# Altium project OSPLC2_2_CPU.PrjPCB
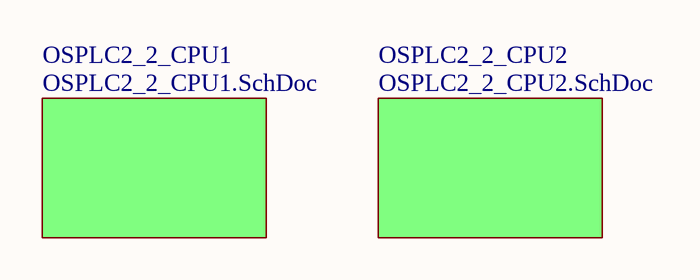
[diagram p0: OSPLC2_2_Top.SchDoc]
3 sheets, 72 parts. Net scope: global (net labels, ports and power ports of the same name join across sheets).
Board file: OSPLC2_2_CPU.PcbDoc
Sheets:
  OSPLC2_2_Top.SchDoc
    OSPLC2_2_CPU1 = OSPLC2_2_CPU1.SchDoc
    OSPLC2_2_CPU2 = OSPLC2_2_CPU2.SchDoc

## Sheet OSPLC2_2_Top.SchDoc
size 294 x 198 mm

### Sub-sheets
OSPLC2_2_CPU1 = OSPLC2_2_CPU1.SchDoc: no entries
OSPLC2_2_CPU2 = OSPLC2_2_CPU2.SchDoc: no entries

## Sheet OSPLC2_2_CPU1.SchDoc
size 294 x 198 mm
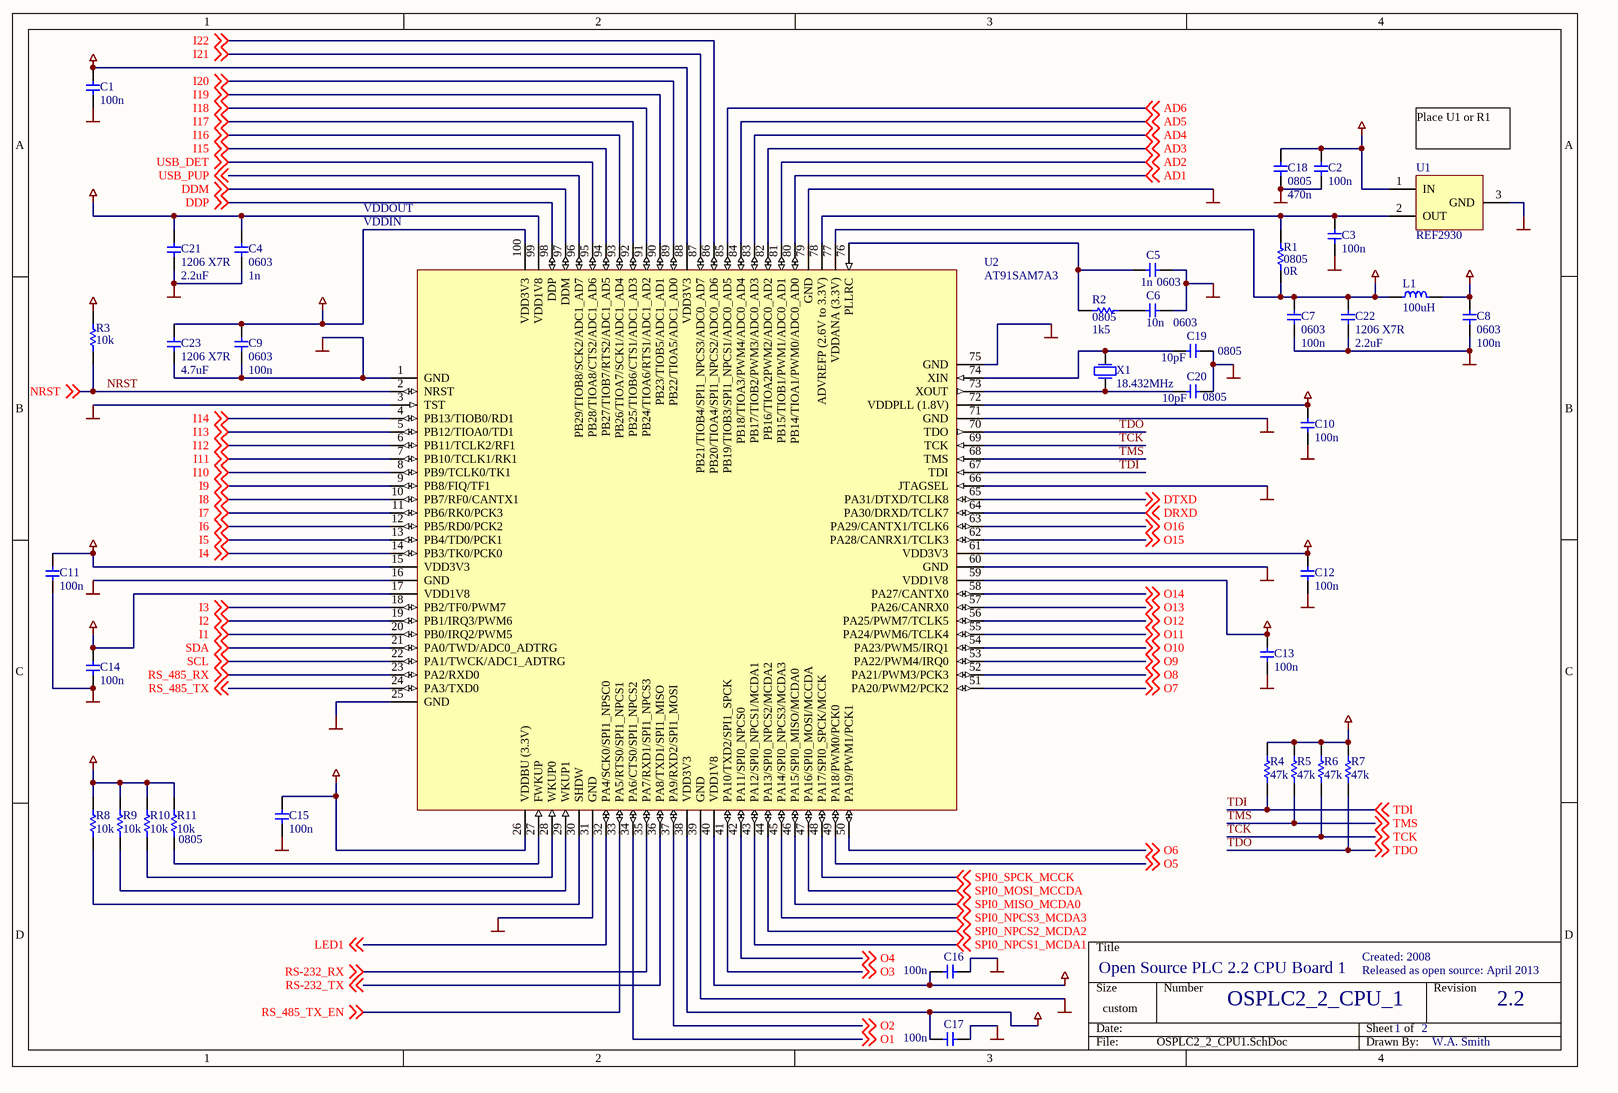
[diagram p1: OSPLC2_2_CPU1.SchDoc]

### Parts
C1  value 100n  [0603]  (hidden comment: 0603)
C2  value 100n  [0603]  (hidden comment: 0603)
C3  value 100n  [0603]  (hidden comment: 0603)
C4  0603  value 1n  [0603]
C5  0603  value 1n  [0603]
C6  0603  value 10n  [0603]
C7  0603  value 100n  [0603]
C8  0603  value 100n  [0603]
C9  0603  value 100n  [0603]
C10  value 100n  [0603]  (hidden comment: 0603)
C11  value 100n  [0603]  (hidden comment: 0603)
C12  value 100n  [0603]  (hidden comment: 0603)
C13  value 100n  [0603]  (hidden comment: 0603)
C14  value 100n  [0603]  (hidden comment: 0603)
C15  value 100n  [0603]  (hidden comment: 0603)
C16  value 100n  [0603]  (hidden comment: 0603)
C17  value 100n  [0603]  (hidden comment: 0603)
C18  0805  value 470n  [0805]
C19  0805  value 10pF  [0805]
C20  0805  value 10pF  [0805]
C21  1206 X7R  value 2.2uF  [1206]
C22  1206 X7R  value 2.2uF  [1206]
C23  1206 X7R  value 4.7uF  [1206]
L1  100uH  [1206]
R1  0805  value 0R  [0805]
R2  0805  value 1k5  [0805]
R3  value 10k  [0805]  (hidden comment: 0805)
R4  value 47k  [0805]  (hidden comment: 0805)
R5  value 47k  [0805]  (hidden comment: 0805)
R6  value 47k  [0805]  (hidden comment: 0805)
R7  value 47k  [0805]  (hidden comment: 0805)
R8  value 10k  [0805]  (hidden comment: 0805)
R9  value 10k  [0805]  (hidden comment: 0805)
R10  value 10k  [0805]  (hidden comment: 0805)
R11  0805  value 10k  [0805]
U1  REF2930  [SOT23-3]
U2  AT91SAM7A3  [F-QFP14x14-G100/X.3N]
X1  18.432MHz  [CRYSTAL_SMT]

### Nets
ADC3v3: C2.2 C7.2 C18.2 C22.2 L1.1 R1.1 U1.1(IN) U2.77(VDDANA_(3.3V))
GND: C1.1 C2.1 C3.1 C4.1 C5.2 C6.2 C7.1 C8.1 C9.1 C10.1 C11.1 C12.1 C13.1 C14.1 C15.1 C16.1 C17.1 C18.1 C19.2 C20.2 C21.1 C22.1 C23.1 U1.3(GND) U2.1(GND) U2.3(TST) U2.16(GND) U2.25(GND) U2.31(GND) U2.39(GND) U2.60(GND) U2.66(JTAGSEL) U2.71(GND) U2.75(GND) U2.79(GND)
VCC1v8: C4.2 C10.2 C13.2 C14.2 C16.2 C21.2 U2.17(VDD1V8) U2.40(VDD1V8) U2.59(VDD1V8) U2.72(VDDPLL_(1.8V)) U2.99(VDD1V8)
VCC3v3: C1.2 C8.2 C9.2 C11.2 C12.2 C15.2 C17.2 C23.2 L1.2 R3.2 R4.2 R5.2 R6.2 R7.2 R8.2 R9.2 R10.2 R11.2 U2.15(VDD3V3) U2.26(VDDBU_(3.3V)) U2.38(VDD3V3) U2.61(VDD3V3) U2.88(VDD3V3) U2.100(VDD3V3)
AD1: U2.80(PB14/TIOA1/PWM0/ADC0_AD0) ; off-sheet AD1
AD2: U2.81(PB15/TIOB1/PWM1/ADC0_AD1) ; off-sheet AD2
AD3: U2.82(PB16/TIOA2PWM2/ADC0_AD2) ; off-sheet AD3
AD4: U2.83(PB17/TIOB2/PWM3/ADC0_AD3) ; off-sheet AD4
AD5: U2.84(PB18/TIOA3/PWM4/ADC0_AD4) ; off-sheet AD5
AD6: U2.85(PB19/TIOB3/SPI1_NPCS1/ADC0_AD5) ; off-sheet AD6
DDM: U2.97(DDM) ; off-sheet DDM
DDP: U2.98(DDP) ; off-sheet DDP
DRXD: U2.64(PA30/DRXD/TCLK7) ; off-sheet DRXD
DTXD: U2.65(PA31/DTXD/TCLK8) ; off-sheet DTXD
I1: U2.20(PB0/IRQ2/PWM5) ; off-sheet I1
I2: U2.19(PB1/IRQ3/PWM6) ; off-sheet I2
I3: U2.18(PB2/TF0/PWM7) ; off-sheet I3
I4: U2.14(PB3/TK0/PCK0) ; off-sheet I4
I5: U2.13(PB4/TD0/PCK1) ; off-sheet I5
I6: U2.12(PB5/RD0/PCK2) ; off-sheet I6
I7: U2.11(PB6/RK0/PCK3) ; off-sheet I7
I8: U2.10(PB7/RF0/CANTX1) ; off-sheet I8
I9: U2.9(PB8/FIQ/TF1) ; off-sheet I9
I10: U2.8(PB9/TCLK0/TK1) ; off-sheet I10
I11: U2.7(PB10/TCLK1/RK1) ; off-sheet I11
I12: U2.6(PB11/TCLK2/RF1) ; off-sheet I12
I13: U2.5(PB12/TIOA0/TD1) ; off-sheet I13
I14: U2.4(PB13/TIOB0/RD1) ; off-sheet I14
I15: U2.94(PB27/TIOB7/RTS2/ADC1_AD5) ; off-sheet I15
I16: U2.93(PB26/TIOA7/SCK1/ADC1_AD4) ; off-sheet I16
I17: U2.92(PB25/TIOB6/CTS1/ADC1_AD3) ; off-sheet I17
I18: U2.91(PB24/TIOA6/RTS1/ADC1_AD2) ; off-sheet I18
I19: U2.90(PB23/TIOB5/ADC1_AD1) ; off-sheet I19
I20: U2.89(PB22/TIOA5/ADC1_AD0) ; off-sheet I20
I21: U2.87(PB21/TIOB4/SPI1_NPCS3/ADC0_AD7) ; off-sheet I21
I22: U2.86(PB20/TIOA4/SPI1_NPCS2/ADC0_AD6) ; off-sheet I22
LED1: U2.32(PA4/SCK0/SPI1_NPSC0) ; off-sheet LED1
NRST: R3.1 U2.2(NRST) ; off-sheet NRST
O1: U2.34(PA6/CTS0/SPI1_NPCS2) ; off-sheet O1
O2: U2.37(PA9/RXD2/SPI1_MOSI) ; off-sheet O2
O3: U2.41(PA10/TXD2/SPI1_SPCK) ; off-sheet O3
O4: U2.42(PA11/SPI0_NPCS0) ; off-sheet O4
O5: U2.49(PA18/PWM0/PCK0) ; off-sheet O5
O6: U2.50(PA19/PWM1/PCK1) ; off-sheet O6
O7: U2.51(PA20/PWM2/PCK2) ; off-sheet O7
O8: U2.52(PA21/PWM3/PCK3) ; off-sheet O8
O9: U2.53(PA22/PWM4/IRQ0) ; off-sheet O9
O10: U2.54(PA23/PWM5/IRQ1) ; off-sheet O10
O11: U2.55(PA24/PWM6/TCLK4) ; off-sheet O11
O12: U2.56(PA25/PWM7/TCLK5) ; off-sheet O12
O13: U2.57(PA26/CANRX0) ; off-sheet O13
O14: U2.58(PA27/CANTX0) ; off-sheet O14
O15: U2.62(PA28/CANRX1/TCLK3) ; off-sheet O15
O16: U2.63(PA29/CANTX1/TCLK6) ; off-sheet O16
RS-232_RX: U2.35(PA7/RXD1/SPI1_NPCS3) ; off-sheet RS-232_RX
RS-232_TX: U2.36(PA8/TXD1/SPI1_MISO) ; off-sheet RS-232_TX
RS_485_RX: U2.23(PA2/RXD0) ; off-sheet RS_485_RX
RS_485_TX: U2.24(PA3/TXD0) ; off-sheet RS_485_TX
RS_485_TX_EN: U2.33(PA5/RTS0/SPI1_NPCS1) ; off-sheet RS_485_TX_EN
SCL: U2.22(PA1/TWCK/ADC1_ADTRG) ; off-sheet SCL
SDA: U2.21(PA0/TWD/ADC0_ADTRG) ; off-sheet SDA
SPI0_MISO_MCDA0: U2.46(PA15/SPI0_MISO/MCDA0) ; off-sheet SPI0_MISO_MCDA0
SPI0_MOSI_MCCDA: U2.47(PA16/SPI0_MOSI/MCCDA) ; off-sheet SPI0_MOSI_MCCDA
SPI0_NPCS1_MCDA1: U2.43(PA12/SPI0_NPCS1/MCDA1) ; off-sheet SPI0_NPCS1_MCDA1
SPI0_NPCS2_MCDA2: U2.44(PA13/SPI0_NPCS2/MCDA2) ; off-sheet SPI0_NPCS2_MCDA2
SPI0_NPCS3_MCDA3: U2.45(PA14/SPI0_NPCS3/MCDA3) ; off-sheet SPI0_NPCS3_MCDA3
SPI0_SPCK_MCCK: U2.48(PA17/SPI0_SPCK/MCCK) ; off-sheet SPI0_SPCK_MCCK
TCK: R6.1 U2.69(TCK) ; off-sheet TCK
TDI: R4.1 U2.67(TDI) ; off-sheet TDI
TDO: R7.1 U2.70(TDO) ; off-sheet TDO
TMS: R5.1 U2.68(TMS) ; off-sheet TMS
USB_DET: U2.95(PB28/TIOA8/CTS2/ADC1_AD6) ; off-sheet USB_DET
USB_PUP: U2.96(PB29/TIOB8/SCK2/ADC1_AD7) ; off-sheet USB_PUP
NetC3_2: C3.2 R1.2 U1.2(OUT) U2.78(ADVREFP_(2.6V_to_3.3V))
NetC5_1: C5.1 R2.1 U2.76(PLLRC)
NetC6_1: C6.1 R2.2
NetC19_1: C19.1 U2.74(XIN) X1.1(X)
NetC20_1: C20.1 U2.73(XOUT) X1.2(X)
NetR8_1: R8.1 U2.30(SHDW)
NetR9_1: R9.1 U2.29(WKUP1)
NetR10_1: R10.1 U2.28(WKUP0)
NetR11_1: R11.1 U2.27(FWKUP)

### Notes on the sheet
- (near U1) Place U1 or R1
- VDDOUT
- (near U2) VDDIN
- Created: 2008
- Open Source PLC 2.2 CPU Board 1
- OSPLC2_2_CPU_1
- Released as open source: April 2013
- 2.2
- 1
- 2
- W.A. Smith

### Library data of the parts
C1-C17 = CAP_0603: 0603 footprint non-polorised capacitor
C18-C20 = CAP_0805: 0805 footprint non-polarised capacitor
C21-C23 = CAP_1206: 1206 footprint non-polorised capacitor
L1 = INDUCTOR_1206: muRata Chip Coil; Part No.: LQH31MN101J03; Value: 100uH
R1-R11 = RES_0805: 0805 footprint resistor
U1 = REF2930: 3V LDO Voltage Reference; Value: REF2930
U2 = AT91SAM7A3: Atmel AT91 ARM Microcontroller with CAN ports; Value: AT91SAM7A3
X1 = CRYSTAL_SMT: SMT crystal

## Sheet OSPLC2_2_CPU2.SchDoc
size 294 x 198 mm
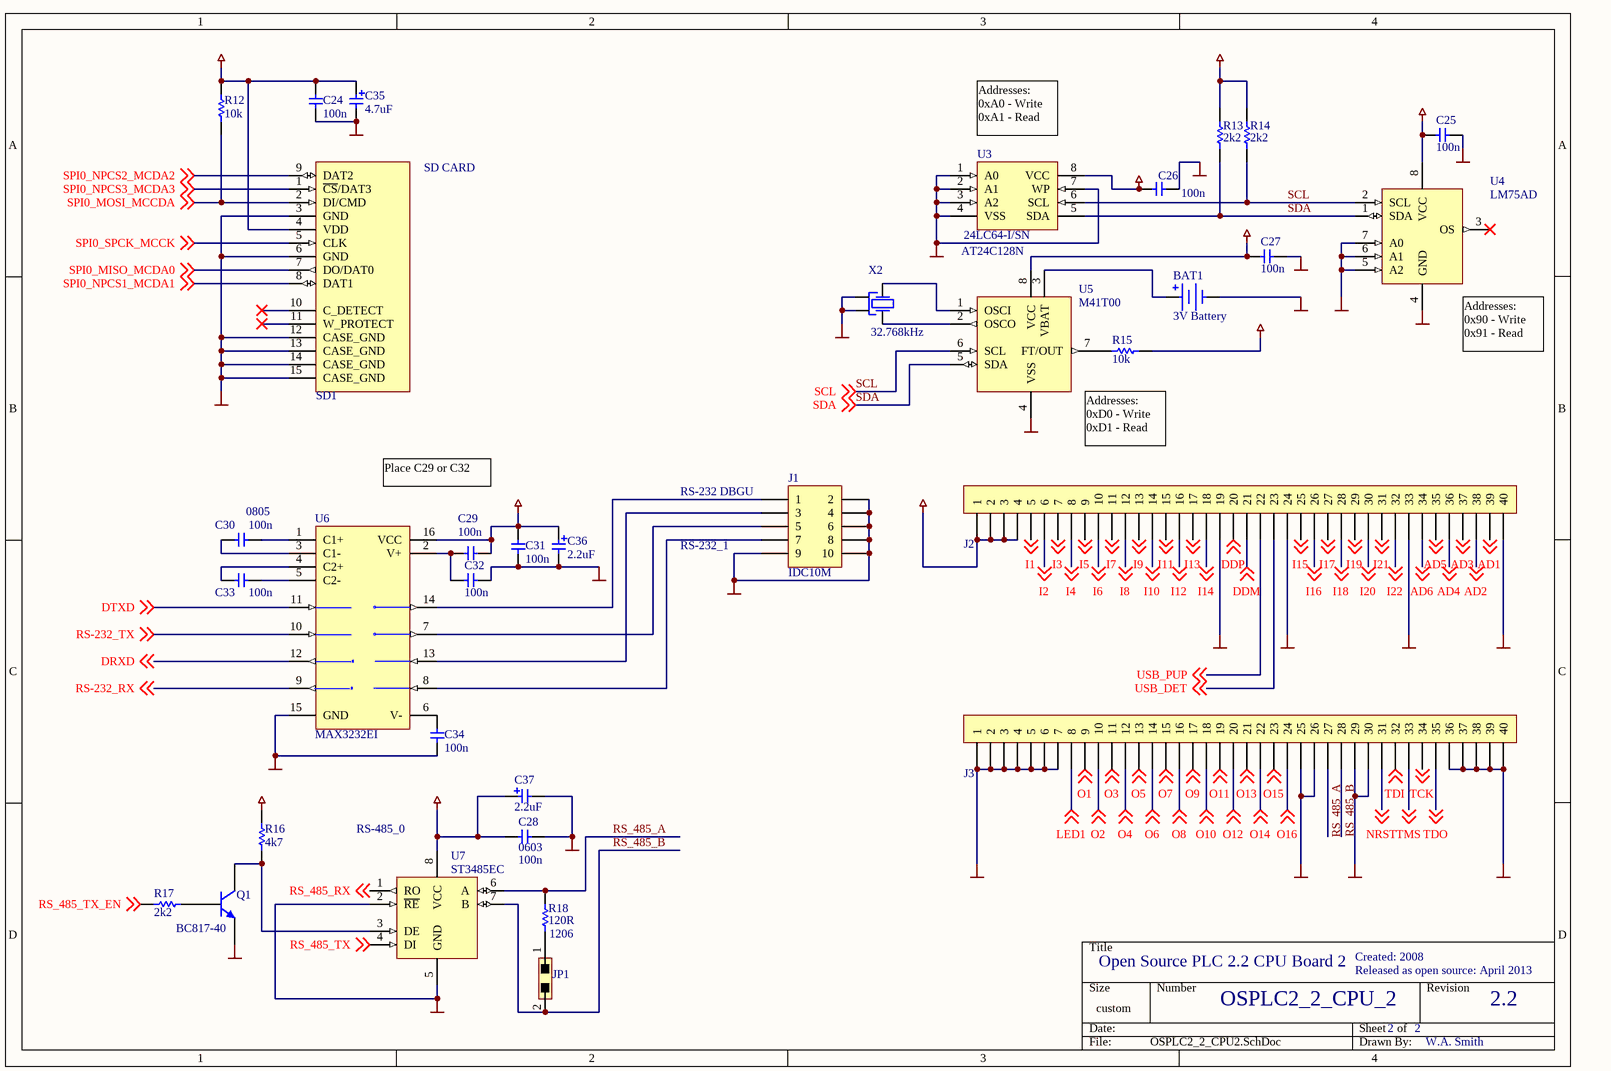
[diagram p2: OSPLC2_2_CPU2.SchDoc]

### Parts
BAT1  3V Battery  [BATTERY_22MM]
C24  value 100n  [0603]  (hidden comment: 0603)
C25  value 100n  [0603]  (hidden comment: 0603)
C26  value 100n  [0603]  (hidden comment: 0603)
C27  value 100n  [0603]  (hidden comment: 0603)
C28  0603  value 100n  [0603]
C29  value 100n  [0805]  (hidden comment: 0805)
C30  0805  value 100n  [0805]
C31  value 100n  [0805]  (hidden comment: 0805)
C32  value 100n  [0805]  (hidden comment: 0805)
C33  value 100n  [0805]  (hidden comment: 0805)
C34  value 100n  [0805]  (hidden comment: 0805)
C35  value 4.7uF  [CAP_TANT_A]  (hidden comment: Tant_A)
C36  value 2.2uF  [CAP_TANT_A]  (hidden comment: Tant_A)
C37  value 2.2uF  [CAP_TANT_A]  (hidden comment: Tant_A)
J1  IDC10M  [IDC_10M_BOX]
J2  HEADER 1 x 40  [HEADER_1_40]  (value not drawn)
J3  HEADER 1 x 40  [HEADER_1_40]  (value not drawn)
JP1  JUMPER2  [JUMPER2_254]  (value not drawn)
Q1  BC817-40  [SO-G3/Y1]
R12  value 10k  [0805]  (hidden comment: 0805)
R13  value 2k2  [0805]  (hidden comment: 0805)
R14  value 2k2  [0805]  (hidden comment: 0805)
R15  value 10k  [0805]  (hidden comment: 0805)
R16  value 4k7  [0805]  (hidden comment: 0805)
R17  value 2k2  [0805]  (hidden comment: 0805)
R18  1206  value 120R  [1206]
SD1  SD Card Connector  [SD_CARD_GS09003P]  (value not drawn)
U3  24LC64-I/SN  value AT24C128N  [SO-G8/Z7.4]
U4  LM75AD  [SO-G8/X.6]
U5  M41T00  [SO-G8/X.6]
U6  MAX3232EI  [SO-G16]
U7  ST3485EC  [SO-G8/Z7.4]
X2  32.768kHz  [SCM200S_SMT]

### Nets
GND: BAT1.2(NEG) C24.1 C25.2 C26.2 C27.2 C28.2 C31.2 C32.1 C34.1 C35.2 C36.2 C37.2 J1.2 J1.4 J1.6 J1.8 J1.9 J1.10 J2.19 J2.24 J2.33 J2.40 J3.1 J3.2 J3.3 J3.4 J3.5 J3.6 J3.7 J3.25 J3.26 J3.29 J3.30 J3.36 J3.37 J3.38 J3.39 J3.40 Q1.2(E) SD1.3(GND) SD1.6(GND) SD1.12(CASE_GND) SD1.13(CASE_GND) SD1.14(CASE_GND) SD1.15(CASE_GND) U3.1(A0) U3.2(A1) U3.3(A2) U3.4(VSS) U3.7(WP) U4.4(GND) U4.5(A2) U4.6(A1) U4.7(A0) U5.4(VSS) U6.15(GND) U7.2(~{RE}) U7.5(GND) X2.2(GND) X2.3(GND)
VCC3v3: C24.2 C25.1 C26.1 C27.1 C28.1 C29.1 C31.1 C35.1 C36.1 C37.1 J2.1 J2.2 J2.3 J2.4 R12.2 R13.2 R14.2 R15.2 R16.2 SD1.4(VDD) U3.8(VCC) U4.8(VCC) U5.8(VCC) U6.16(VCC) U7.8(VCC)
AD1: J2.39 ; off-sheet AD1
AD2: J2.38 ; off-sheet AD2
AD3: J2.37 ; off-sheet AD3
AD4: J2.36 ; off-sheet AD4
AD5: J2.35 ; off-sheet AD5
AD6: J2.34 ; off-sheet AD6
DDM: J2.21 ; off-sheet DDM
DDP: J2.20 ; off-sheet DDP
DRXD: U6.12(R1OUT) ; off-sheet DRXD
DTXD: U6.11(T1IN) ; off-sheet DTXD
I1: J2.5 ; off-sheet I1
I2: J2.6 ; off-sheet I2
I3: J2.7 ; off-sheet I3
I4: J2.8 ; off-sheet I4
I5: J2.9 ; off-sheet I5
I6: J2.10 ; off-sheet I6
I7: J2.11 ; off-sheet I7
I8: J2.12 ; off-sheet I8
I9: J2.13 ; off-sheet I9
I10: J2.14 ; off-sheet I10
I11: J2.15 ; off-sheet I11
I12: J2.16 ; off-sheet I12
I13: J2.17 ; off-sheet I13
I14: J2.18 ; off-sheet I14
I15: J2.25 ; off-sheet I15
I16: J2.26 ; off-sheet I16
I17: J2.27 ; off-sheet I17
I18: J2.28 ; off-sheet I18
I19: J2.29 ; off-sheet I19
I20: J2.30 ; off-sheet I20
I21: J2.31 ; off-sheet I21
I22: J2.32 ; off-sheet I22
LED1: J3.8 ; off-sheet LED1
NRST: J3.31 ; off-sheet NRST
O1: J3.9 ; off-sheet O1
O2: J3.10 ; off-sheet O2
O3: J3.11 ; off-sheet O3
O4: J3.12 ; off-sheet O4
O5: J3.13 ; off-sheet O5
O6: J3.14 ; off-sheet O6
O7: J3.15 ; off-sheet O7
O8: J3.16 ; off-sheet O8
O9: J3.17 ; off-sheet O9
O10: J3.18 ; off-sheet O10
O11: J3.19 ; off-sheet O11
O12: J3.20 ; off-sheet O12
O13: J3.21 ; off-sheet O13
O14: J3.22 ; off-sheet O14
O15: J3.23 ; off-sheet O15
O16: J3.24 ; off-sheet O16
RS-232_RX: U6.9(R2OUT) ; off-sheet RS-232_RX
RS-232_TX: U6.10(T2IN) ; off-sheet RS-232_TX
RS_485_A: J3.27 R18.2 U7.6(A)
RS_485_B: J3.28 JP1.2 U7.7(B)
RS_485_RX: U7.1(RO) ; off-sheet RS_485_RX
RS_485_TX: U7.4(DI) ; off-sheet RS_485_TX
RS_485_TX_EN: R17.2 ; off-sheet RS_485_TX_EN
SCL: R14.1 U3.6(SCL) U4.2(SCL) U5.6(SCL) ; off-sheet SCL
SDA: R13.1 U3.5(SDA) U4.1(SDA) U5.5(SDA) ; off-sheet SDA
SPI0_MISO_MCDA0: SD1.7(DO/DAT0) ; off-sheet SPI0_MISO_MCDA0
SPI0_MOSI_MCCDA: R12.1 SD1.2(DI/CMD) ; off-sheet SPI0_MOSI_MCCDA
SPI0_NPCS1_MCDA1: SD1.8(DAT1) ; off-sheet SPI0_NPCS1_MCDA1
SPI0_NPCS2_MCDA2: SD1.9(DAT2) ; off-sheet SPI0_NPCS2_MCDA2
SPI0_NPCS3_MCDA3: SD1.1(~{CS}/DAT3) ; off-sheet SPI0_NPCS3_MCDA3
SPI0_SPCK_MCCK: SD1.5(CLK) ; off-sheet SPI0_SPCK_MCCK
TCK: J3.34 ; off-sheet TCK
TDI: J3.32 ; off-sheet TDI
TDO: J3.35 ; off-sheet TDO
TMS: J3.33 ; off-sheet TMS
USB_DET: J2.23 ; off-sheet USB_DET
USB_PUP: J2.22 ; off-sheet USB_PUP
NetBAT1_1: BAT1.1(POS) U5.3(VBAT)
NetC29_2: C29.2 C32.2 U6.2(V+)
NetC30_1: C30.1 U6.1(C1+)
NetC30_2: C30.2 U6.3(C1-)
NetC33_1: C33.1 U6.5(C2-)
NetC33_2: C33.2 U6.4(C2+)
NetC34_2: C34.2 U6.6(V-)
NetJ1_1: J1.1 U6.14(T1OUT)
NetJ1_3: J1.3 U6.13(R1IN)
NetJ1_5: J1.5 U6.7(T2OUT)
NetJ1_7: J1.7 U6.8(R2IN)
NetJP1_1: JP1.1 R18.1
NetQ1_1: Q1.1(B) R17.1
NetQ1_3: Q1.3(C) R16.1 U7.3(DE)
NetR15_1: R15.1 U5.7(FT/OUT)
NetU5_1: U5.1(OSCI) X2.1(X)
NetU5_2: U5.2(OSCO) X2.4(X)

Not connected (* = marked no-connect by the designer): SD1 10(C_DETECT)* 11(W_PROTECT)*; U4 3(OS)*

### Notes on the sheet
- (near U3) Addresses:
  0xA0 - Write
  0xA1 - Read
- SD CARD
- (near U4) Addresses:
  0x90 - Write
  0x91 - Read
- Place C29 or C32
- (near U5) Addresses:
  0xD0 - Write
  0xD1 - Read
- (near J1) RS-232 DBGU
- RS-232_1
- (near U7) RS-485_0
- Created: 2008
- Open Source PLC 2.2 CPU Board 2
- OSPLC2_2_CPU_2
- Released as open source: April 2013
- 2.2
- 2
- W.A. Smith

### Library data of the parts
BAT1 = BATTERY_22MM: 3 Volt Lithium Button Battery
C24-C28 = CAP_0603: 0603 footprint non-polorised capacitor
C29-C34 = CAP_0805: 0805 footprint non-polarised capacitor
C35-C37 = CAP_TANT_A: Tantalum Capacitor, A Package
J1 = IDC_10M: 10 pin IDC male connector, vertical, box
J2 J3 = HEADER_1_40: 2.54mm header, 1 by 40; Value: HEADER_1_40_2.54
JP1 = JUMPER2: 2 Pin Jumper, 2.54mm
Q1 = BC817-40: NPN General Purpose Amplifier; Manufacturer: Fairchild Semiconductor; Revision 1: 11-July-2000: SIM Model Added.; Revision 2: July-2002: Re-released for DXP Platform.; Package Information: Latest Revision: Sep-1998; Class I: Discrete; Class II: BJT - Low Power; Published: 8-Jun-2000; Datasheet: Latest Revision: 1997; Package Reference: SOT-23A; Publisher: Altium Limited; Value: BC817-40
R12-R17 = RES_0805: 0805 footprint resistor
R18 = RES_1206: 1206 footprint resistor
SD1 = SD_CARD_GSD09003P: Secure Digital Card Connector, Amphenol, GSD09003P; Value: SD_CARD_HOLDER
U3 = 24LC64-I/SN: Microchip 64k bit I2C bus serial EEPROM
U4 = LM75AD: Phillips Digital temperature sensor and thermal Watchdog
U5 = M41T00: ST Serial Access Timekeeper; Value: M41T00
U6 = MAX3232ESE: 3.0V TO 5.5V, Low-Power, up to 1Mbps, True RS-232 Transceiver Using Four 0.1µF External Capacitor; Manufacturer: Maxim; Class I: Communication; Published: 16-Jan-2001; Revision: July-2002: Re-released for DXP Platform.; Datasheet: Latest Revision: Mar-1999; Package Reference: NSO16; Publisher: Altium Limited; Class II: Transceiver; Value: MAX3232EI
U7 = ST3485EC: ST 3.3v RS-485/RS-422 Transceiver; Value: ST3485EC
X2 = SCM200S: SMT 32.768kHz Crystal; Value: SCM200S-32.768kHz

## Nets that join several sheets
GND: OSPLC2_2_CPU1 (35 pins), OSPLC2_2_CPU2 (60 pins)
VCC3v3: OSPLC2_2_CPU1 (24 pins), OSPLC2_2_CPU2 (25 pins)
AD1: OSPLC2_2_CPU1 (U2.80), OSPLC2_2_CPU2 (J2.39)
AD2: OSPLC2_2_CPU1 (U2.81), OSPLC2_2_CPU2 (J2.38)
AD3: OSPLC2_2_CPU1 (U2.82), OSPLC2_2_CPU2 (J2.37)
AD4: OSPLC2_2_CPU1 (U2.83), OSPLC2_2_CPU2 (J2.36)
AD5: OSPLC2_2_CPU1 (U2.84), OSPLC2_2_CPU2 (J2.35)
AD6: OSPLC2_2_CPU1 (U2.85), OSPLC2_2_CPU2 (J2.34)
DDM: OSPLC2_2_CPU1 (U2.97), OSPLC2_2_CPU2 (J2.21)
DDP: OSPLC2_2_CPU1 (U2.98), OSPLC2_2_CPU2 (J2.20)
DRXD: OSPLC2_2_CPU1 (U2.64), OSPLC2_2_CPU2 (U6.12)
DTXD: OSPLC2_2_CPU1 (U2.65), OSPLC2_2_CPU2 (U6.11)
I1: OSPLC2_2_CPU1 (U2.20), OSPLC2_2_CPU2 (J2.5)
I2: OSPLC2_2_CPU1 (U2.19), OSPLC2_2_CPU2 (J2.6)
I3: OSPLC2_2_CPU1 (U2.18), OSPLC2_2_CPU2 (J2.7)
I4: OSPLC2_2_CPU1 (U2.14), OSPLC2_2_CPU2 (J2.8)
I5: OSPLC2_2_CPU1 (U2.13), OSPLC2_2_CPU2 (J2.9)
I6: OSPLC2_2_CPU1 (U2.12), OSPLC2_2_CPU2 (J2.10)
I7: OSPLC2_2_CPU1 (U2.11), OSPLC2_2_CPU2 (J2.11)
I8: OSPLC2_2_CPU1 (U2.10), OSPLC2_2_CPU2 (J2.12)
I9: OSPLC2_2_CPU1 (U2.9), OSPLC2_2_CPU2 (J2.13)
I10: OSPLC2_2_CPU1 (U2.8), OSPLC2_2_CPU2 (J2.14)
I11: OSPLC2_2_CPU1 (U2.7), OSPLC2_2_CPU2 (J2.15)
I12: OSPLC2_2_CPU1 (U2.6), OSPLC2_2_CPU2 (J2.16)
I13: OSPLC2_2_CPU1 (U2.5), OSPLC2_2_CPU2 (J2.17)
I14: OSPLC2_2_CPU1 (U2.4), OSPLC2_2_CPU2 (J2.18)
I15: OSPLC2_2_CPU1 (U2.94), OSPLC2_2_CPU2 (J2.25)
I16: OSPLC2_2_CPU1 (U2.93), OSPLC2_2_CPU2 (J2.26)
I17: OSPLC2_2_CPU1 (U2.92), OSPLC2_2_CPU2 (J2.27)
I18: OSPLC2_2_CPU1 (U2.91), OSPLC2_2_CPU2 (J2.28)
I19: OSPLC2_2_CPU1 (U2.90), OSPLC2_2_CPU2 (J2.29)
I20: OSPLC2_2_CPU1 (U2.89), OSPLC2_2_CPU2 (J2.30)
I21: OSPLC2_2_CPU1 (U2.87), OSPLC2_2_CPU2 (J2.31)
I22: OSPLC2_2_CPU1 (U2.86), OSPLC2_2_CPU2 (J2.32)
LED1: OSPLC2_2_CPU1 (U2.32), OSPLC2_2_CPU2 (J3.8)
NRST: OSPLC2_2_CPU1 (R3.1 U2.2), OSPLC2_2_CPU2 (J3.31)
O1: OSPLC2_2_CPU1 (U2.34), OSPLC2_2_CPU2 (J3.9)
O2: OSPLC2_2_CPU1 (U2.37), OSPLC2_2_CPU2 (J3.10)
O3: OSPLC2_2_CPU1 (U2.41), OSPLC2_2_CPU2 (J3.11)
O4: OSPLC2_2_CPU1 (U2.42), OSPLC2_2_CPU2 (J3.12)
O5: OSPLC2_2_CPU1 (U2.49), OSPLC2_2_CPU2 (J3.13)
O6: OSPLC2_2_CPU1 (U2.50), OSPLC2_2_CPU2 (J3.14)
O7: OSPLC2_2_CPU1 (U2.51), OSPLC2_2_CPU2 (J3.15)
O8: OSPLC2_2_CPU1 (U2.52), OSPLC2_2_CPU2 (J3.16)
O9: OSPLC2_2_CPU1 (U2.53), OSPLC2_2_CPU2 (J3.17)
O10: OSPLC2_2_CPU1 (U2.54), OSPLC2_2_CPU2 (J3.18)
O11: OSPLC2_2_CPU1 (U2.55), OSPLC2_2_CPU2 (J3.19)
O12: OSPLC2_2_CPU1 (U2.56), OSPLC2_2_CPU2 (J3.20)
O13: OSPLC2_2_CPU1 (U2.57), OSPLC2_2_CPU2 (J3.21)
O14: OSPLC2_2_CPU1 (U2.58), OSPLC2_2_CPU2 (J3.22)
O15: OSPLC2_2_CPU1 (U2.62), OSPLC2_2_CPU2 (J3.23)
O16: OSPLC2_2_CPU1 (U2.63), OSPLC2_2_CPU2 (J3.24)
RS-232_RX: OSPLC2_2_CPU1 (U2.35), OSPLC2_2_CPU2 (U6.9)
RS-232_TX: OSPLC2_2_CPU1 (U2.36), OSPLC2_2_CPU2 (U6.10)
RS_485_RX: OSPLC2_2_CPU1 (U2.23), OSPLC2_2_CPU2 (U7.1)
RS_485_TX: OSPLC2_2_CPU1 (U2.24), OSPLC2_2_CPU2 (U7.4)
RS_485_TX_EN: OSPLC2_2_CPU1 (U2.33), OSPLC2_2_CPU2 (R17.2)
SCL: OSPLC2_2_CPU1 (U2.22), OSPLC2_2_CPU2 (R14.1 U3.6 U4.2 U5.6)
SDA: OSPLC2_2_CPU1 (U2.21), OSPLC2_2_CPU2 (R13.1 U3.5 U4.1 U5.5)
SPI0_MISO_MCDA0: OSPLC2_2_CPU1 (U2.46), OSPLC2_2_CPU2 (SD1.7)
SPI0_MOSI_MCCDA: OSPLC2_2_CPU1 (U2.47), OSPLC2_2_CPU2 (R12.1 SD1.2)
SPI0_NPCS1_MCDA1: OSPLC2_2_CPU1 (U2.43), OSPLC2_2_CPU2 (SD1.8)
SPI0_NPCS2_MCDA2: OSPLC2_2_CPU1 (U2.44), OSPLC2_2_CPU2 (SD1.9)
SPI0_NPCS3_MCDA3: OSPLC2_2_CPU1 (U2.45), OSPLC2_2_CPU2 (SD1.1)
SPI0_SPCK_MCCK: OSPLC2_2_CPU1 (U2.48), OSPLC2_2_CPU2 (SD1.5)
TCK: OSPLC2_2_CPU1 (R6.1 U2.69), OSPLC2_2_CPU2 (J3.34)
TDI: OSPLC2_2_CPU1 (R4.1 U2.67), OSPLC2_2_CPU2 (J3.32)
TDO: OSPLC2_2_CPU1 (R7.1 U2.70), OSPLC2_2_CPU2 (J3.35)
TMS: OSPLC2_2_CPU1 (R5.1 U2.68), OSPLC2_2_CPU2 (J3.33)
USB_DET: OSPLC2_2_CPU1 (U2.95), OSPLC2_2_CPU2 (J2.23)
USB_PUP: OSPLC2_2_CPU1 (U2.96), OSPLC2_2_CPU2 (J2.22)